# Altium schematic sheet Audio Codec.SchDoc
size A4
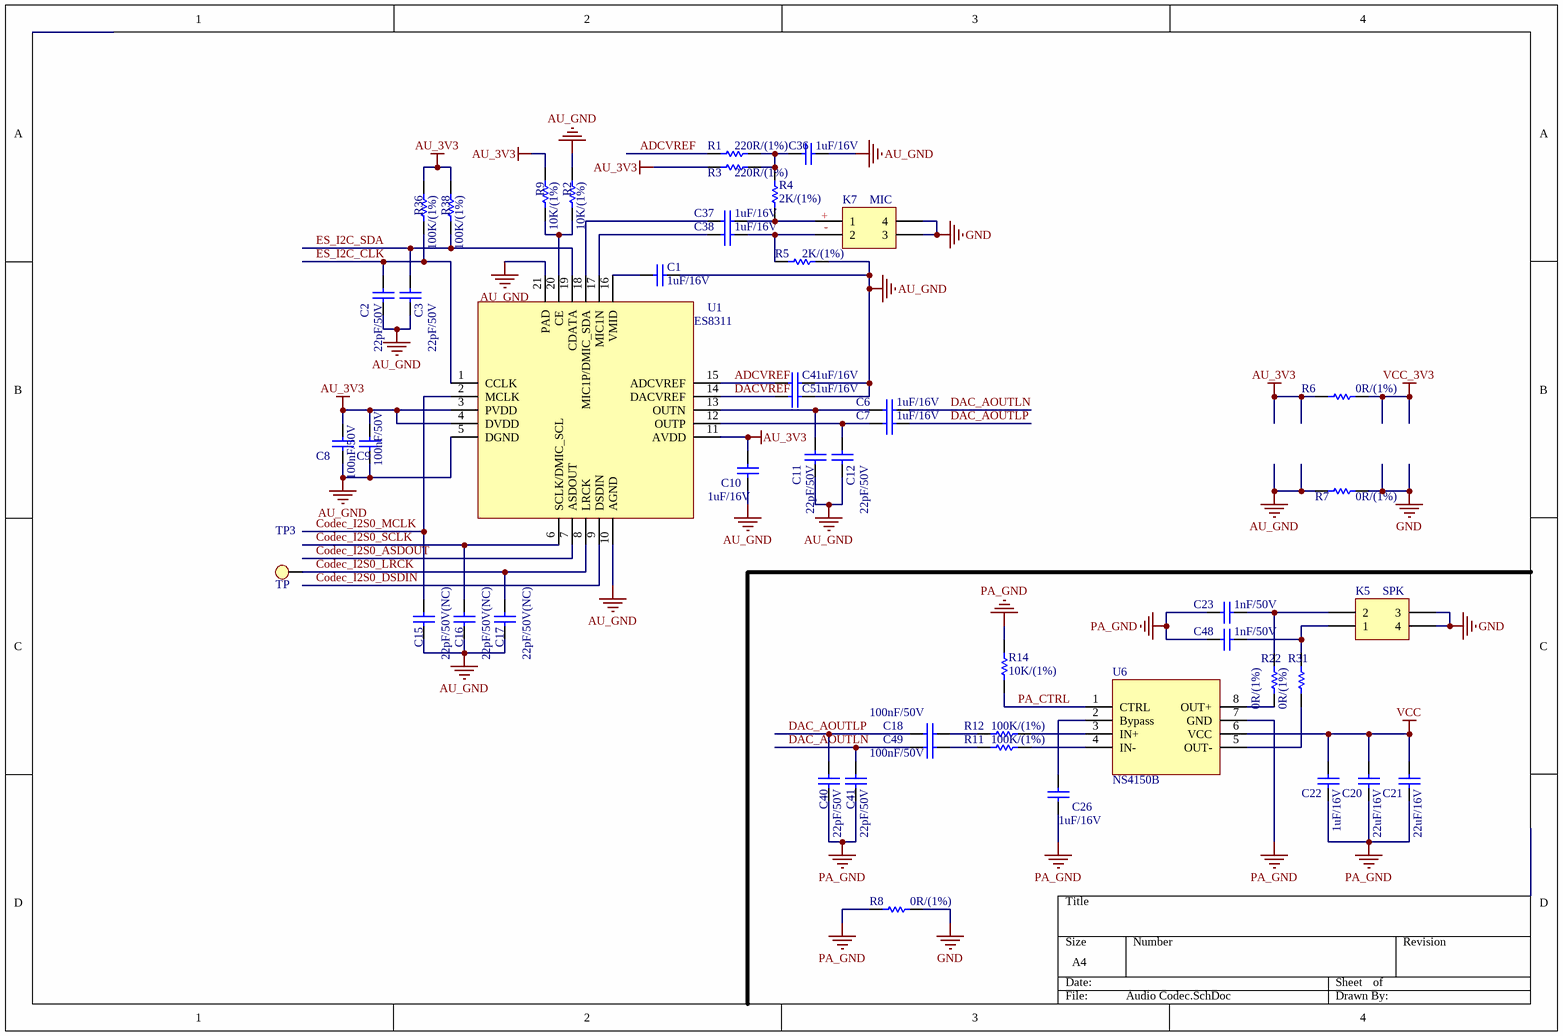
[diagram p0: Audio Codec.SchDoc]

## Parts
C1  1uF/16V  [C0402]
C2  22pF/50V  [C0402]
C3  22pF/50V  [C0402]
C4  1uF/16V  [C0402]
C5  1uF/16V  [C0402]
C6  1uF/16V  [C0402]
C7  1uF/16V  [C0402]
C8  100nF/50V  [C0402]
C9  100nF/50V  [C0402]
C10  1uF/16V  [C0402]
C11  22pF/50V  [C0402]
C12  22pF/50V  [C0402]
C15  22pF/50V(NC)  [C0402]
C16  22pF/50V(NC)  [C0402]
C17  22pF/50V(NC)  [C0402]
C18  100nF/50V  [C0402]
C20  22uF/16V  [C0402]
C21  22uF/16V  [C0402]
C22  1uF/16V  [C0402]
C23  1nF/50V  [C0402]
C26  1uF/16V  [C0402]
C36  1uF/16V  [C0402]
C37  1uF/16V  [C0402]
C38  1uF/16V  [C0402]
C40  22pF/50V  [C0402]
C41  22pF/50V  [C0402]
C48  1nF/50V  [C0402]
C49  100nF/50V  [C0402]
K5  SPK  [HC-1.25-2PWT]
K7  MIC  [HC-1.25-2PWT]
R1  220R/(1%)  [R0402]
R2  10K/(1%)  [R0402]
R3  220R/(1%)  [R0402]
R4  2K/(1%)  [R0402]
R5  2K/(1%)  [R0402]
R6  0R/(1%)  [R0402]
R7  0R/(1%)  [R0402]
R8  0R/(1%)  [R0402]
R9  10K/(1%)  [R0402]
R11  100K/(1%)  [R0402]
R12  100K/(1%)  [R0402]
R14  10K/(1%)  [R0402]
R22  0R/(1%)  [R0402]
R31  0R/(1%)  [R0402]
R36  100K/(1%)  [R0402]
R38  100K/(1%)  [R0402]
TP3  TP  [TEST_SMD]
U1  ES8311  [WQFN-20-EP(3x3)_ES8311]
U6  NS4150B  [MSOP-8_L3.0-W3.0]

## Nets
AU_3V3: C8.2 C9.2 C10.2 R3.1 R6.1 R9.2 R36.1 R38.1 U1.3(PVDD) U1.4(DVDD) U1.11(AVDD)
AU_GND: C1.2 C2.1 C3.1 C4.2 C5.2 C8.1 C9.1 C10.1 C11.1 C12.1 C15.1 C16.1 C17.1 C36.2 R2.2 R5.2 R7.1 U1.5(DGND) U1.10(AGND) U1.21(PAD)
GND: K5.3 K5.4 K7.3 K7.4 R7.2 R8.2
PA_GND: C20.1 C21.1 C22.1 C23.2 C26.2 C40.1 C41.1 C48.2 R8.1 R14.2 U6.7(GND)
VCC: C20.2 C21.2 C22.2 U6.6(VCC)
VCC_3V3: R6.2
ADCVREF: C4.1 R1.1 U1.15(ADCVREF)
Codec_I2S0_ASDOUT: U1.7(ASDOUT)
Codec_I2S0_DSDIN: U1.9(DSDIN)
Codec_I2S0_LRCK: C17.2 TP3.1 U1.8(LRCK)
Codec_I2S0_MCLK: C15.2 U1.2(MCLK)
Codec_I2S0_SCLK: C16.2 U1.6(SCLK/DMIC_SCL)
DAC_AOUTLN: C6.1 C41.2 C49.2
DAC_AOUTLP: C7.1 C18.2 C40.2
DACVREF: C5.1 U1.14(DACVREF)
ES_I2C_CLK: C2.2 R36.2 U1.1(CCLK)
ES_I2C_SDA: C3.2 R38.2 U1.19(CDATA)
PA_CTRL: R14.1 U6.1(CTRL)
NetC1_1: C1.1 U1.16(VMID)
NetC6_2: C6.2 C11.2 U1.13(OUTN)
NetC7_2: C7.2 C12.2 U1.12(OUTP)
NetC18_1: C18.1 R12.2
NetC23_1: C23.1 K5.2 R22.2
NetC26_1: C26.1 U6.2(Bypass)
NetC36_1: C36.1 R1.2 R3.2 R4.1
NetC37_1: C37.1 U1.18(MIC1P/DMIC_SDA)
NetC37_2: C37.2 K7.1 R4.2
NetC38_1: C38.1 U1.17(MIC1N)
NetC38_2: C38.2 K7.2 R5.1
NetC48_1: C48.1 K5.1 R31.2
NetC49_1: C49.1 R11.2
NetR2_1: R2.1 R9.1 U1.20(CE)
NetR11_1: R11.1 U6.4(IN-)
NetR12_1: R12.1 U6.3(IN+)
NetR22_1: R22.1 U6.8(OUT+)
NetR31_1: R31.1 U6.5(OUT-)

## Notes on the sheet
- (near K7) +
- (near K7) -

## Library data of the parts
C1-C12 C15-C18 C20-C23 C26 C36-C38 C40 C41 C48 C49 = Cap: Capacitor; Value: 100pF; Published: 8-Jun-2000; LatestRevisionDate: 17-Jul-2002; LatestRevisionNote: Re-released for DXP Platform.; PackageReference: RAD-0.3; Publisher: Altium Limited
K5 K7 = Header 2X2: Header, 2-Pin, Dual row; LatestRevisionDate: 17-Jul-2002; LatestRevisionNote: Re-released for DXP Platform.; Publisher: Altium Limited
R1-R9 R11 R12 R14 R22 R31 R36 R38 = Res1: Resistor; Value: 1K; Published: 8-Jun-2000; LatestRevisionDate: 17-Jul-2002; LatestRevisionNote: Re-released for DXP Platform.; PackageReference: AXIAL-0.3; Publisher: Altium Limited
U6 = NS4150